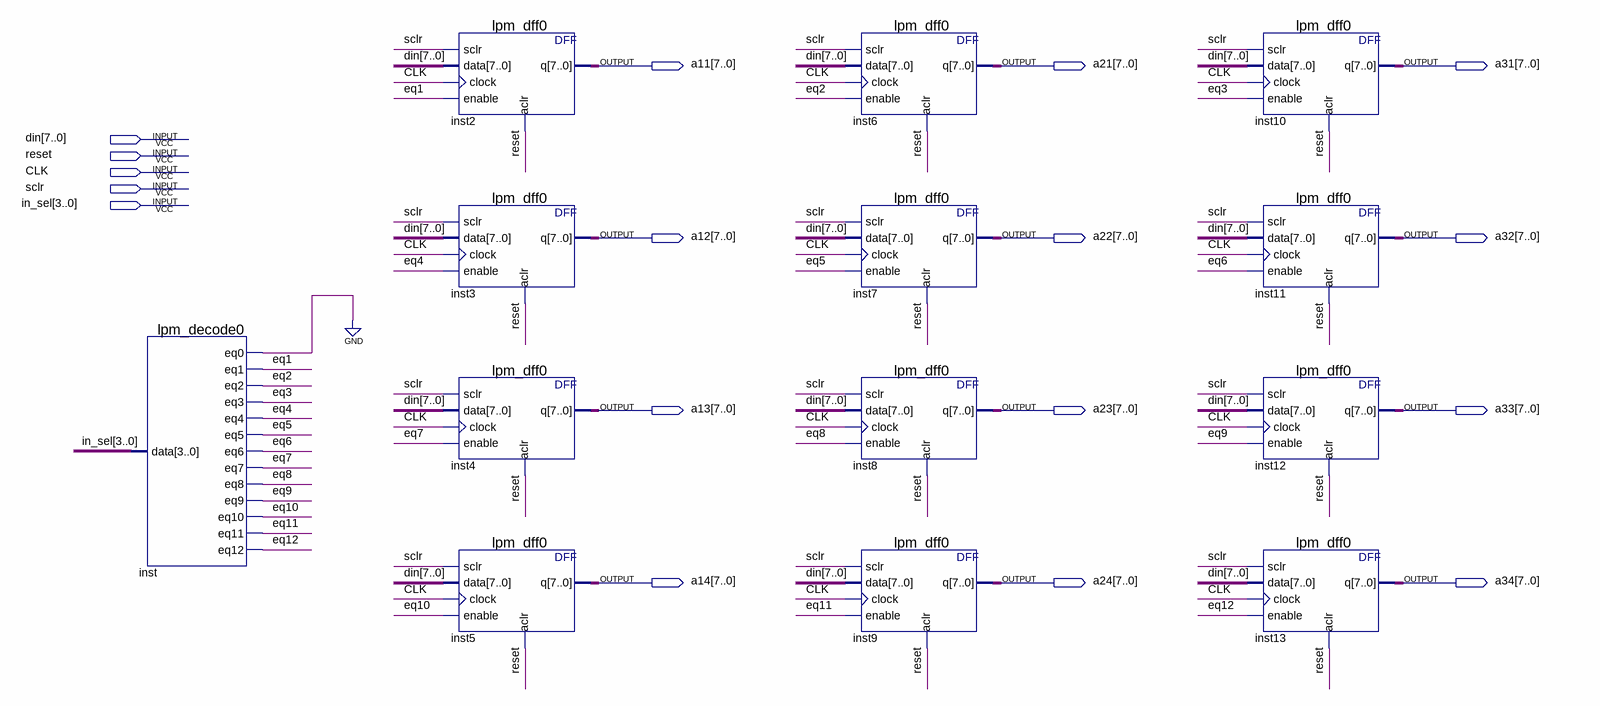
[diagram p0: schematic sheet]
// Quartus schematic in_reg.bdf as structural Verilog: 13 symbols, 17 pins
module in_reg (
  input  [7:0] din,
  input  reset,
  input  CLK,
  input  sclr,
  input  [3:0] in_sel,
  output [7:0] a11,
  output [7:0] a21,
  output [7:0] a31,
  output [7:0] a12,
  output [7:0] a22,
  output [7:0] a32,
  output [7:0] a13,
  output [7:0] a23,
  output [7:0] a33,
  output [7:0] a14,
  output [7:0] a24,
  output [7:0] a34
);

  wire eq1, eq2, eq3, eq4, eq5, eq6, eq7, eq8, eq9, eq10, eq11, eq12, inst_eq0;

  lpm_decode0 inst (
    .data(in_sel), .eq0(inst_eq0), .eq1(eq1), .eq2(eq2), .eq3(eq3), .eq4(eq4), .eq5(eq5), .eq6(eq6),
    .eq7(eq7), .eq8(eq8), .eq9(eq9), .eq10(eq10), .eq11(eq11), .eq12(eq12));
  lpm_dff0 inst2 (.sclr(sclr), .data(din), .clock(CLK), .enable(eq1), .aclr(reset), .q(a11));
  lpm_dff0 inst3 (.sclr(sclr), .data(din), .clock(CLK), .enable(eq4), .aclr(reset), .q(a12));
  lpm_dff0 inst4 (.sclr(sclr), .data(din), .clock(CLK), .enable(eq7), .aclr(reset), .q(a13));
  lpm_dff0 inst5 (.sclr(sclr), .data(din), .clock(CLK), .enable(eq10), .aclr(reset), .q(a14));
  lpm_dff0 inst6 (.sclr(sclr), .data(din), .clock(CLK), .enable(eq2), .aclr(reset), .q(a21));
  lpm_dff0 inst7 (.sclr(sclr), .data(din), .clock(CLK), .enable(eq5), .aclr(reset), .q(a22));
  lpm_dff0 inst8 (.sclr(sclr), .data(din), .clock(CLK), .enable(eq8), .aclr(reset), .q(a23));
  lpm_dff0 inst9 (.sclr(sclr), .data(din), .clock(CLK), .enable(eq11), .aclr(reset), .q(a24));
  lpm_dff0 inst10 (.sclr(sclr), .data(din), .clock(CLK), .enable(eq3), .aclr(reset), .q(a31));
  lpm_dff0 inst11 (.sclr(sclr), .data(din), .clock(CLK), .enable(eq6), .aclr(reset), .q(a32));
  lpm_dff0 inst12 (.sclr(sclr), .data(din), .clock(CLK), .enable(eq9), .aclr(reset), .q(a33));
  lpm_dff0 inst13 (.sclr(sclr), .data(din), .clock(CLK), .enable(eq12), .aclr(reset), .q(a34));
  // also tied to GND on the sheet: inst_eq0
endmodule
